# EAGLE schematic led-motion-sensor-v1 (EAGLE 6.4)
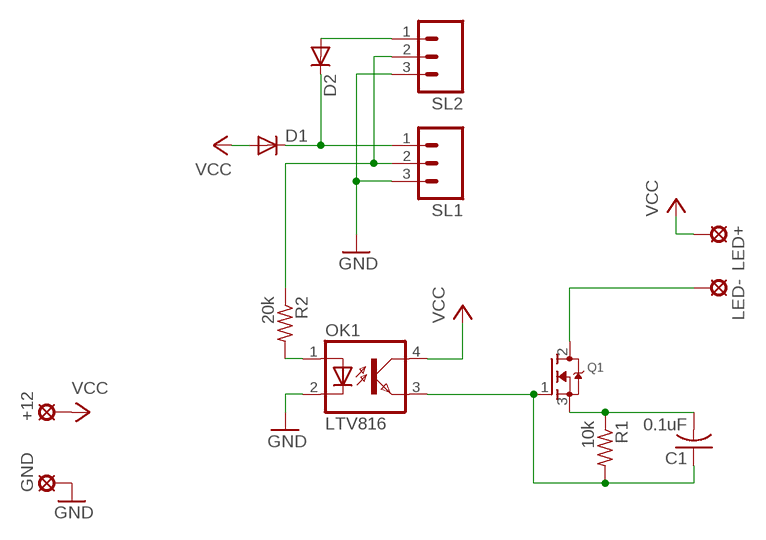
[diagram p0: schematic, sheet 1]

## Parts
+12  LSP10  [LSP10]
C1  0.1uF  C-USC0603K  [C0603K]
D1  DIODE-MICROMELF-W  [MICROMELF-W]
D2  DIODE-MICROMELF-W  [MICROMELF-W]
GND  LSP10  [LSP10]
LED+  LSP10  [LSP10]
LED-  LSP10  [LSP10]
OK1  LTV816  [DIL04]
Q1  MOSFET-NGDS_TO220V  [TO220V]
R1  10k  R-US_R0603  [R0603]
R2  20k  R-US_R0603  [R0603]
SL1  M03  [03P]
SL2  M03  [03P]

## Nets
GND: GND.MP OK1.2(C) SL1.3 SL2.3
N$1: R2.1 SL1.2 SL2.2
N$2: C1.1 OK1.3(EMIT) Q1.1(G) R1.2
N$3: C1.2 Q1.3(S) R1.1
N$4: OK1.1(A) R2.2
N$5: LED-.MP Q1.2(D)
N$6: D1.C D2.C SL1.1
N$7: D2.A SL2.1
VCC: +12.MP D1.A LED+.MP OK1.4(COL)

## Library data of the parts
+12 GND LED+ LED- = solpad:LSP10: SOLDER PAD drill 1.0 mm, distributor Buerklin, 12H555
C1 = adafruit:C-US: CAPACITOR, American symbol
D1 D2 = diode:DIODE-: DIODE
OK1 = optocoupler:LTV816: OPTO COUPLER Source: LITEON, LTV816.pdf; OC_FARNELL: unknown; OC_NEWARK: unknown
Q1 = adafruit:MOSFET-N: N-Channel Mosfet 2N7002E - 60V 260mA SOT23 [Digikey: 2N7002ET1GOSTR-ND] - REEL BSH103 - 30V 850mA SOT23 [Digikey: 568-5013-1-ND]
R1 R2 = adafruit:R-US_: RESISTOR, American symbol
SL1 SL2 = con-amp-quick:M03: AMP QUICK CONNECTOR; OC_FARNELL: unknown; OC_NEWARK: unknown